# Altium schematic sheet 04-ZYNQ BANK 501.SchDoc
size 513 x 386 mm
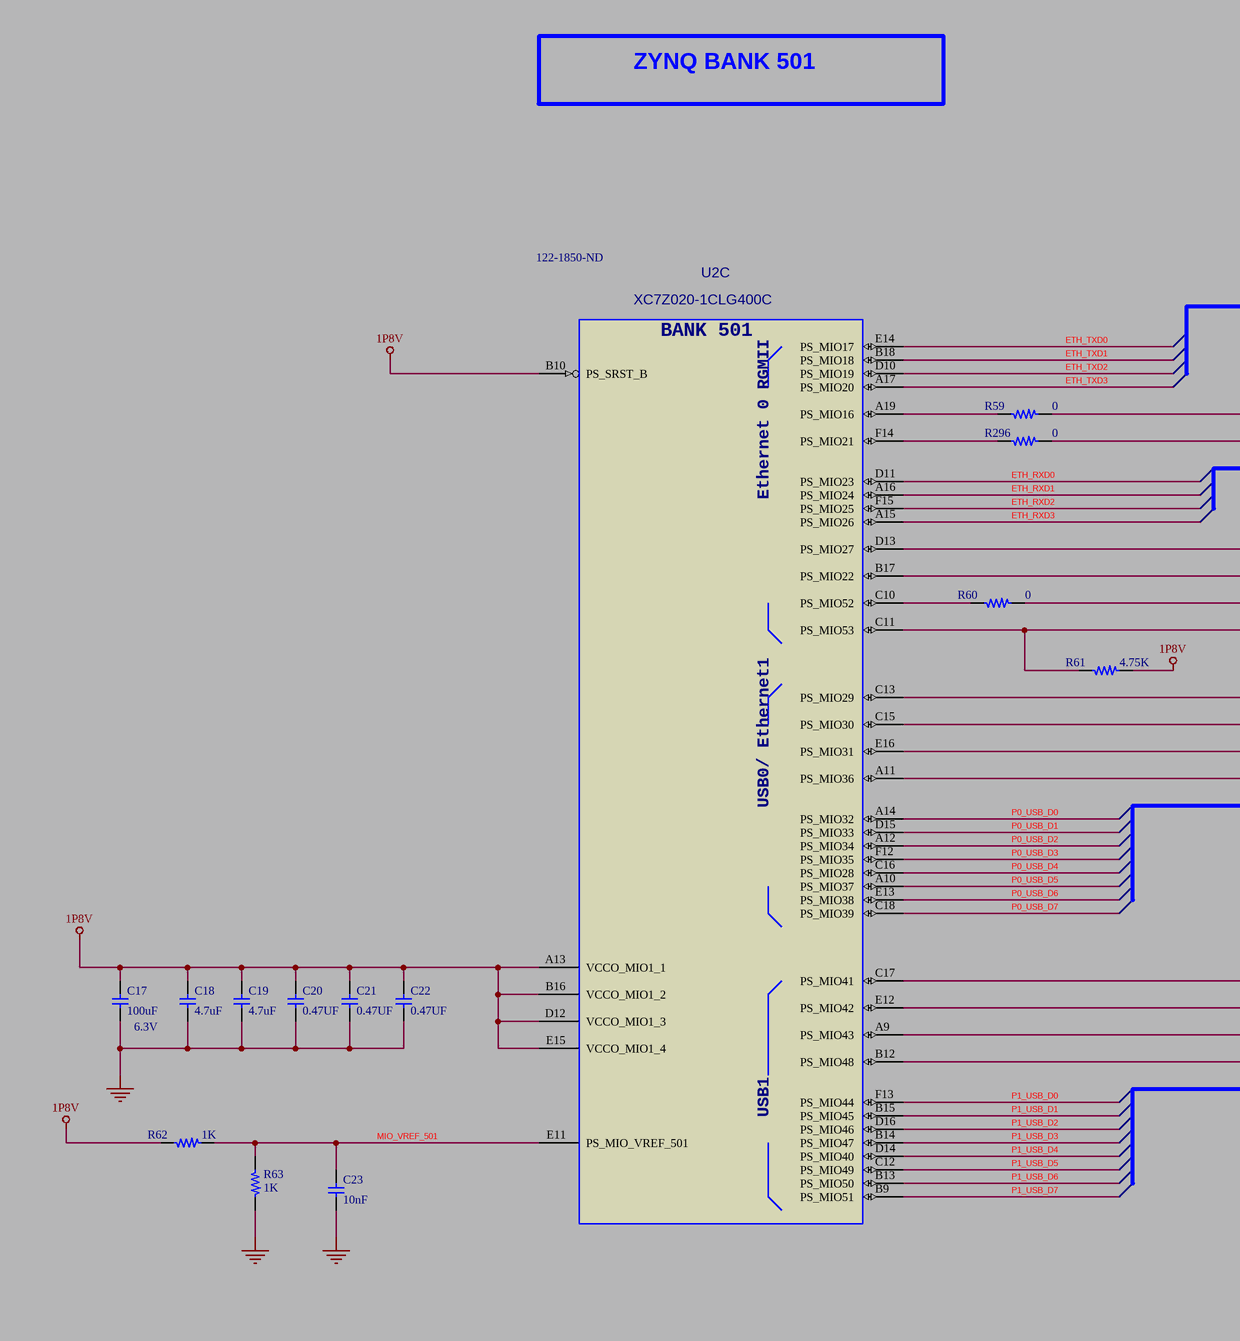
[diagram p0: 04-ZYNQ BANK 501.SchDoc, left]
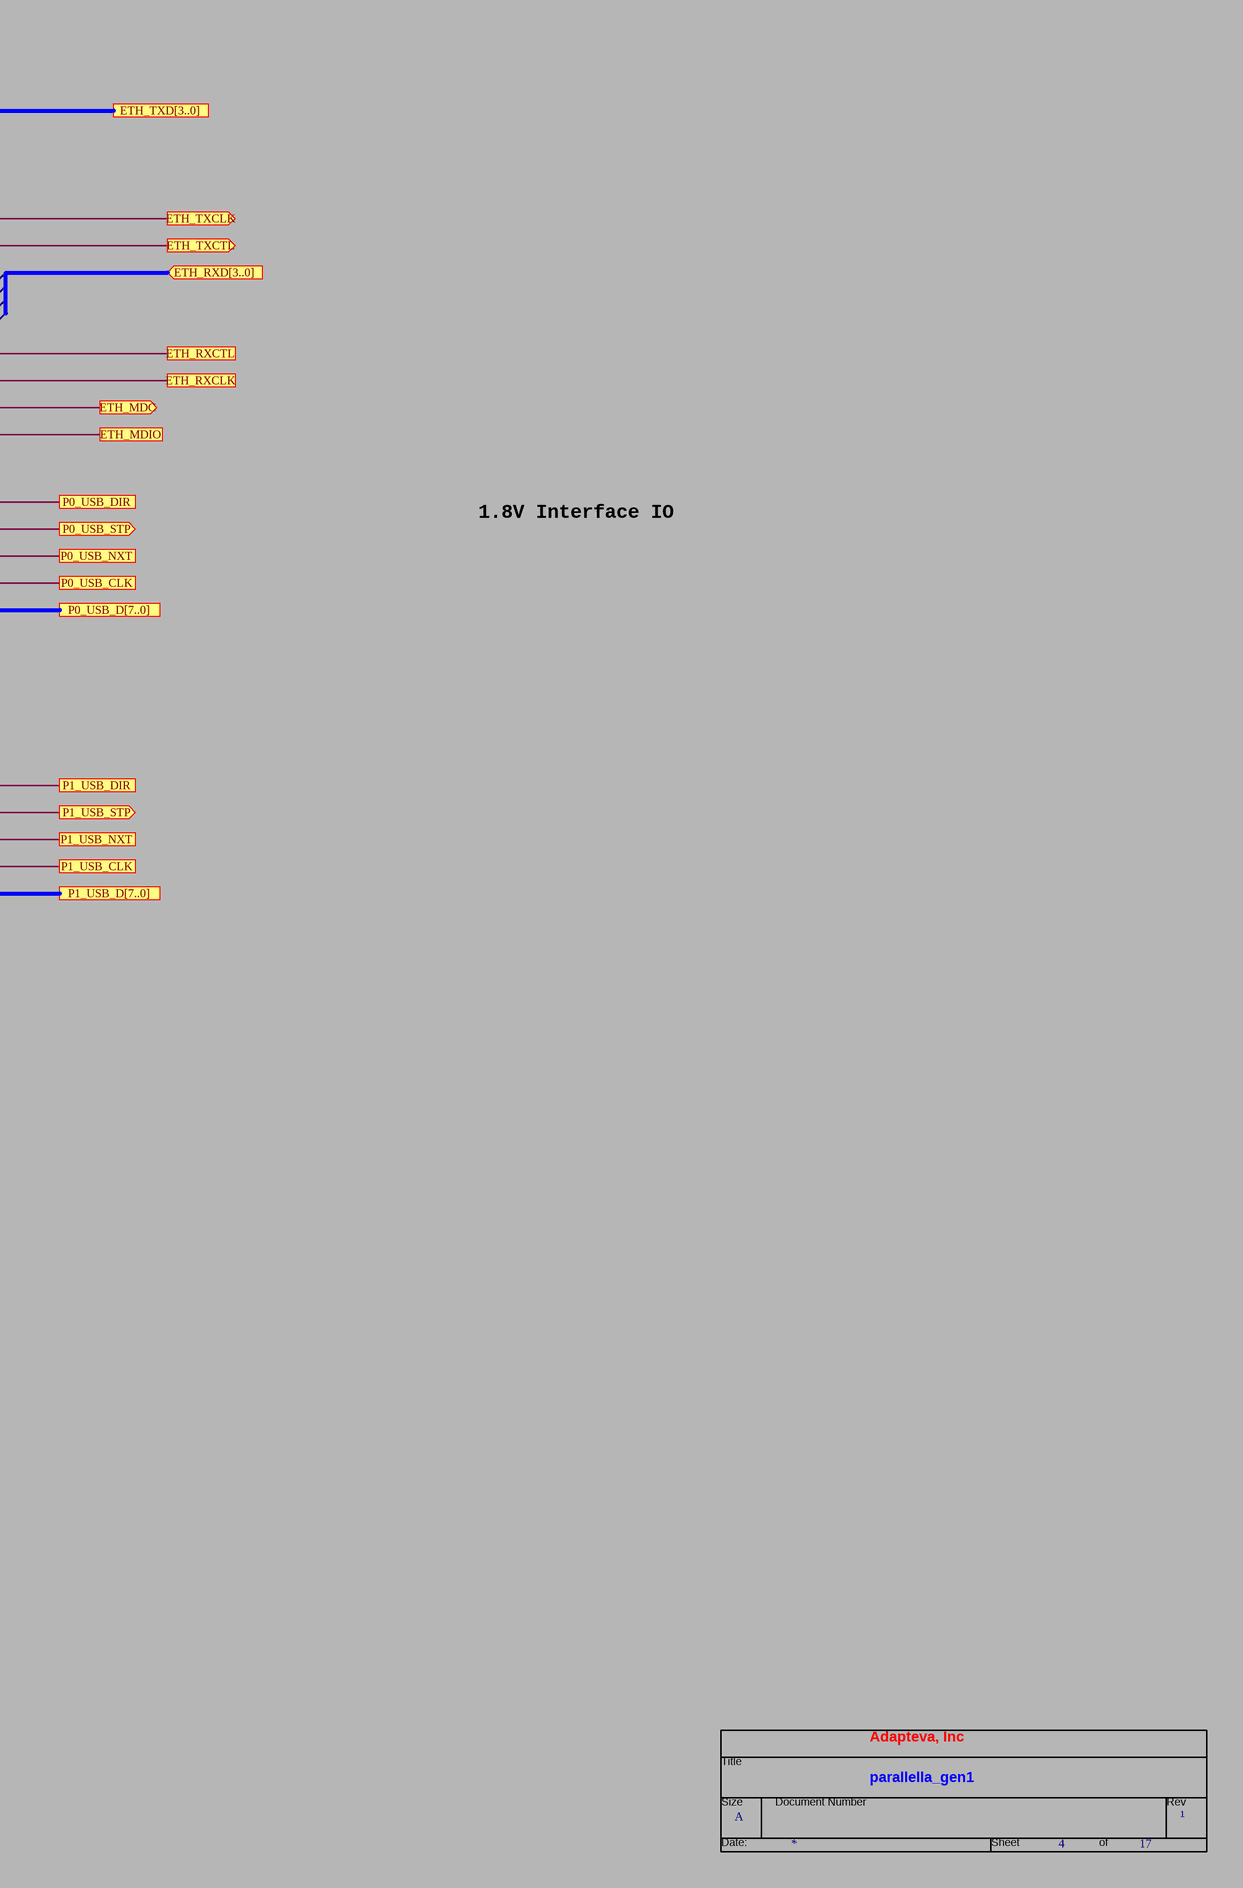
[diagram p1: 04-ZYNQ BANK 501.SchDoc, right]

## Parts
*  RevCode: 1  Title: parallella_gen1  Page Size: A  Page Number: 4  Page Count: 17  OrgAddr1: Adapteva, Inc  (hidden comment: TitleBlock0)  (graphical)
C17  100uF  VOLTAGE: 6.3V  [C1210]
C18  4.7uF  [C0402]
C19  4.7uF  [C0402]
C20  0.47UF  [C0402]
C21  0.47UF  [C0402]
C22  0.47UF  [C0402]
C23  10nF  [C0402]
R59  0  [R0402]
R60  0  [R0402]
R61  4.75K  [R0402]
R62  1K  [R0402]
R63  1K  [R0402]
R296  0  [R0402]
U2  Vendor PN: XC7Z020-1CLG400C  Supplier Part Number 1: 122-1850-ND  [CBGA400_17SQ_1P6H_P8MMP]  (hidden comment: 7Z020-CLG400)  (part C of 8)

## Ports
ETH_MDC (out), ETH_MDIO, ETH_RXCLK, ETH_RXCTL, ETH_RXD[3..0] (in), ETH_TXCLK (out), ETH_TXCTL (out), ETH_TXD[3..0], P0_USB_CLK, P0_USB_D[7..0], P0_USB_DIR, P0_USB_NXT, P0_USB_STP (out), P1_USB_CLK, P1_USB_D[7..0], P1_USB_DIR, P1_USB_NXT, P1_USB_STP (out)

## Nets
1P8V: C17.1 C18.1 C19.1 C20.1 C21.1 C22.1 R61.2 R62.1 U2.A13(VCCO_MIO1_1) U2.B10(PS_SRST_B) U2.B16(VCCO_MIO1_2) U2.D12(VCCO_MIO1_3) U2.E15(VCCO_MIO1_4)
GND: C17.2 C18.2 C19.2 C20.2 C21.2 C22.2 C23.2 R63.2
ETH_MDC: R60.2 ; port ETH_MDC
ETH_MDIO: R61.1 U2.C11(PS_MIO53) ; port ETH_MDIO
ETH_RXCLK: U2.B17(PS_MIO22) ; port ETH_RXCLK
ETH_RXCTL: U2.D13(PS_MIO27) ; port ETH_RXCTL
ETH_RXD0: U2.D11(PS_MIO23)
ETH_RXD1: U2.A16(PS_MIO24)
ETH_RXD2: U2.F15(PS_MIO25)
ETH_RXD3: U2.A15(PS_MIO26)
ETH_TXCLK: R59.2 ; port ETH_TXCLK
ETH_TXCTL: R296.2 ; port ETH_TXCTL
ETH_TXD0: U2.E14(PS_MIO17)
ETH_TXD1: U2.B18(PS_MIO18)
ETH_TXD2: U2.D10(PS_MIO19)
ETH_TXD3: U2.A17(PS_MIO20)
MIO_VREF_501: C23.1 R62.2 R63.1 U2.E11(PS_MIO_VREF_501)
P0_USB_CLK: U2.A11(PS_MIO36) ; port P0_USB_CLK
P0_USB_D0: U2.A14(PS_MIO32)
P0_USB_D1: U2.D15(PS_MIO33)
P0_USB_D2: U2.A12(PS_MIO34)
P0_USB_D3: U2.F12(PS_MIO35)
P0_USB_D4: U2.C16(PS_MIO28)
P0_USB_D5: U2.A10(PS_MIO37)
P0_USB_D6: U2.E13(PS_MIO38)
P0_USB_D7: U2.C18(PS_MIO39)
P0_USB_DIR: U2.C13(PS_MIO29) ; port P0_USB_DIR
P0_USB_NXT: U2.E16(PS_MIO31) ; port P0_USB_NXT
P0_USB_STP: U2.C15(PS_MIO30) ; port P0_USB_STP
P1_USB_CLK: U2.B12(PS_MIO48) ; port P1_USB_CLK
P1_USB_D0: U2.F13(PS_MIO44)
P1_USB_D1: U2.B15(PS_MIO45)
P1_USB_D2: U2.D16(PS_MIO46)
P1_USB_D3: U2.B14(PS_MIO47)
P1_USB_D4: U2.D14(PS_MIO40)
P1_USB_D5: U2.C12(PS_MIO49)
P1_USB_D6: U2.B13(PS_MIO50)
P1_USB_D7: U2.B9(PS_MIO51)
P1_USB_DIR: U2.C17(PS_MIO41) ; port P1_USB_DIR
P1_USB_NXT: U2.A9(PS_MIO43) ; port P1_USB_NXT
P1_USB_STP: U2.E12(PS_MIO42) ; port P1_USB_STP
NetR59_1: R59.1 U2.A19(PS_MIO16)
NetR60_1: R60.1 U2.C10(PS_MIO52)
NetR296_1: R296.1 U2.F14(PS_MIO21)

## Notes on the sheet
- ZYNQ BANK 501
- 1.8V Interface IO
- (in symbol TitleBlock0) Title; Size; Document Number; Rev; Date:; Sheet; of
- (in symbol ZYNQ_7Z020_CLG400, part C) BANK 501; Ethernet 0 RGMII; USB0/ Ethernet1; USB1

## Library data of the parts
C17 = CAP1210_100UF_X5R_LOESR: CAP, 1210, 100UF, X5R, 6.3V, LOW ESR; MFG PART NO: GRM32ER60J107ME20L; MFG: MURATA; DEVICE: CAP1210_100UF_X5R_LOESR; Vendor: MURATA; Vendor PN: GRM32ER60J107ME20L; PCB Footprint: C1210
C18 C19 = CAP0402_4P7UF_X5R: CAP, 0402, 4.7UF, X5R, 6.3V; MFG PART NO: C1005X5R0J475K; MFG: TDK; ALT_SYMBOLS: C0402_BGA; DEVICE: CAP0402_4P7UF_X5R; Vendor: TDK; Vendor PN: C1005X5R0J475K; PCB Footprint: C0402
C20-C22 = CAP0402_0P47UF_X5R: CAP, 0402, 0.47UF, X5R, 16V; MFG PART NO: C1005X5R1C474K; MFG: TDK; ALT_SYMBOLS: C0402_BGA; DEVICE: CAP0402_0P47UF_X5R; Vendor: TDK; Vendor PN: C1005X5R1C474K; PCB Footprint: C0402
C23 = CAP0402_10NF_X7R_16V: CAP, 0402, 10NF, X7R, 16V; MFG PART NO: C1005X7R1C103K; MFG: TDK; ALT_SYMBOLS: C0402_BGA; Vendor: TDK; Vendor PN: C1005X7R1C103K; PCB Footprint: C0402
R59 R60 R296 = RES0402_0: RES, 0402, 0 OHM, 1%; MFG PART NO: CRCW04020000Z0ED; ALT_SYMBOLS: R0402_BGA; MFG: VISHAY; Vendor: VISHAY/DALE; DEVICE: RES0402_0; Vendor PN: CRCW04020000Z0ED; PCB Footprint: R0402
R61 = RES0402_4K75: RES, 0402, 4.75K, 1%; MFG PART NO: CRCW04024K75FKED; MFG: VISHAY; Vendor: VISHAY/DALE; ALT_SYMBOLS: R0402_BGA; DEVICE: RES0402_4K75; Vendor PN: CRCW04024K75FKED; PCB Footprint: R0402
R62 R63 = RES0402_1K: RES, 0402, 1K; MFG PART NO: CRCW04021K00FKED; ALT_SYMBOLS: R0402_BGA; MFG: VISHAY; Vendor: VISHAY/DALE; DEVICE: RES0402_1K; Vendor PN: CRCW04021K00FKED; PCB Footprint: R0402
U2 = ZYNQ_7Z020_CLG400: IC, EPP, XILINX, ZYNQ, 7Z020, CLG400; SPLIT_INST: TRUE; Vendor: XILINX; DEVICE: ZYNQ_7Z020_CLG400; PCB Footprint: CBGA400_17SQ_1P6H_P8MMP; Supplier 1: Digi-Key
* = TitleBlock0: Page Create Date: March  8, 1995; Page Modify Date: *